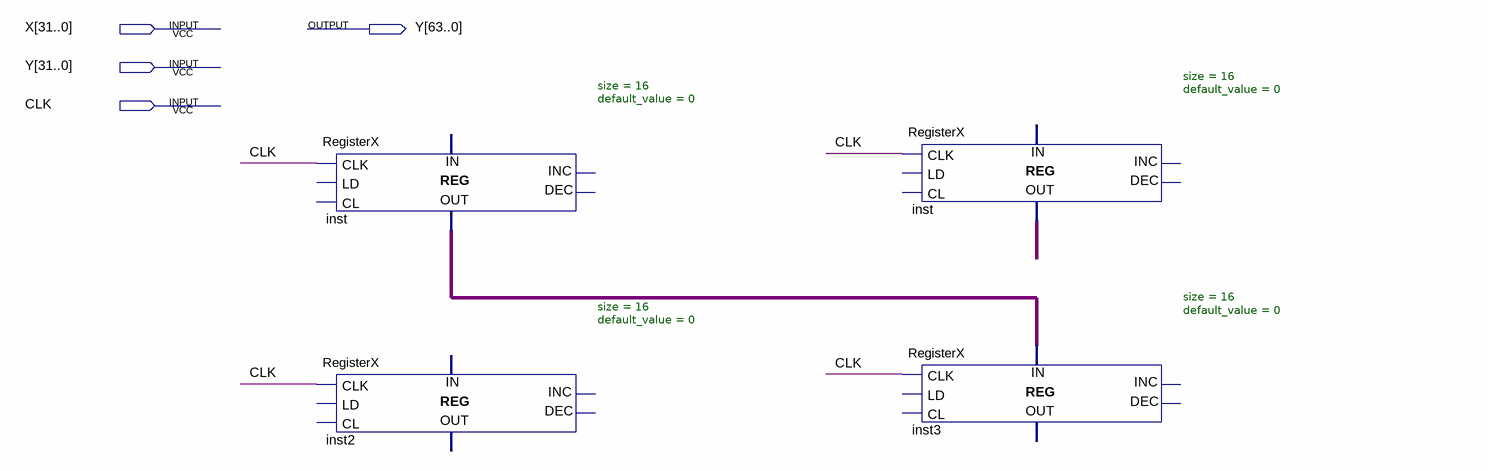
[diagram p0: schematic sheet]
// Quartus schematic MUL_SEQ_64.bdf as structural Verilog: 4 symbols, 4 pins
module MUL_SEQ_64 (
  input  [31:0] X,
  inout  [63:0] Y,
  input  CLK
);

  wire [15:0] inst_data_out, inst_data_out_2;

  RegisterX #(.size(16), .default_value(0)) inst (
    .CLK(CLK), .DATA_OUT(inst_data_out));  // open: LD, CL, INC, DEC, DATA_IN
  RegisterX #(.size(16), .default_value(0)) inst2 (.CLK(CLK));  // open: LD, CL, INC, DEC, DATA_IN, DATA_OUT
  RegisterX #(.size(16), .default_value(0)) inst_dup2 (
    .CLK(CLK), .DATA_OUT(inst_data_out_2));  // open: LD, CL, INC, DEC, DATA_IN
  RegisterX #(.size(16), .default_value(0)) inst3 (
    .CLK(CLK), .DATA_IN(inst_data_out));  // open: LD, CL, INC, DEC, DATA_OUT
endmodule
